# EAGLE design mainboard-raspi (EAGLE 6.4)
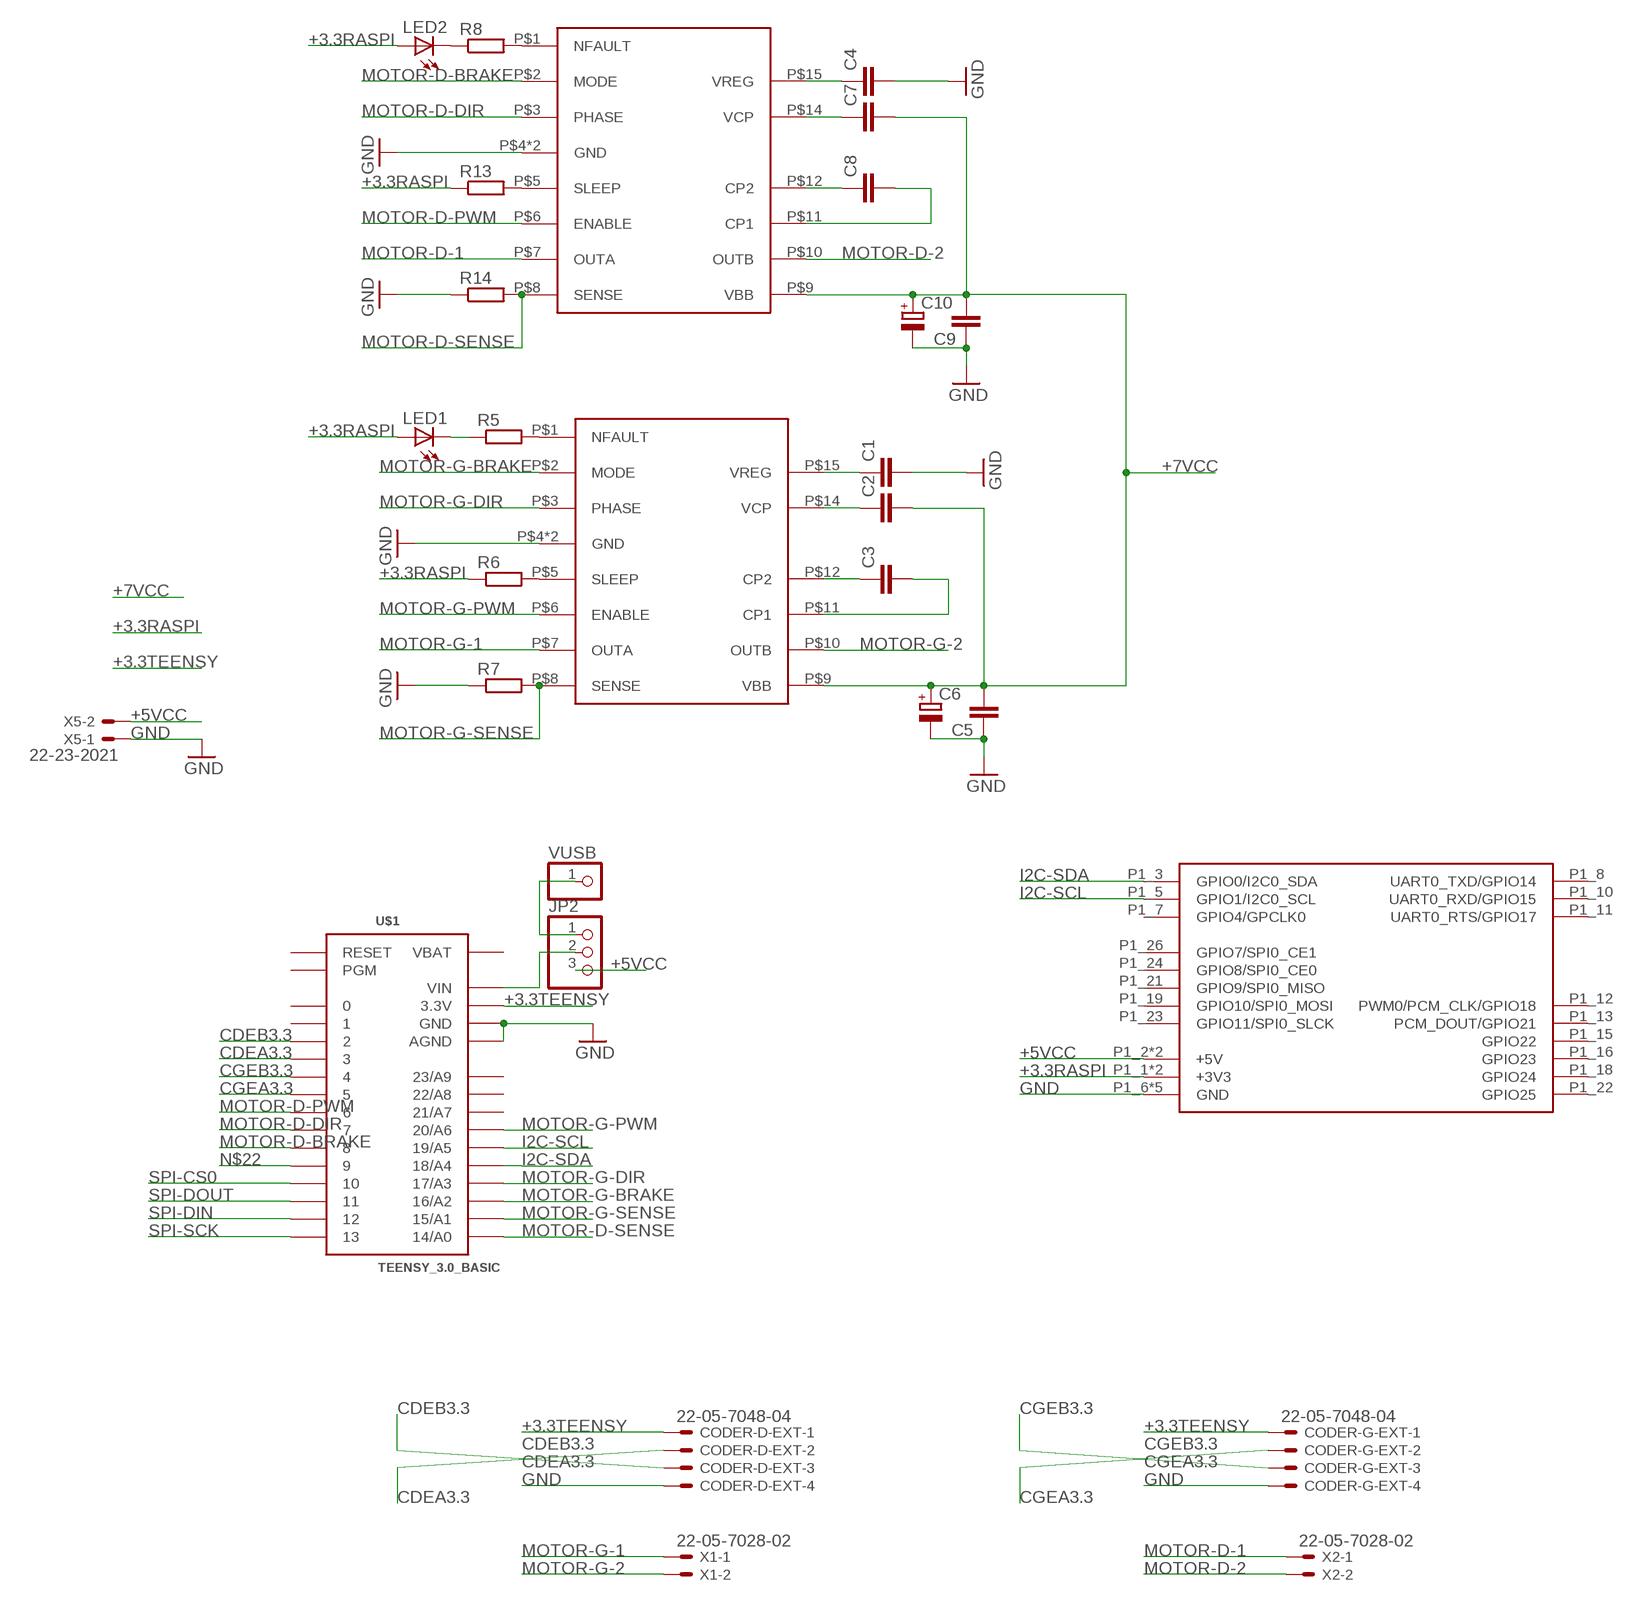
[diagram p0: schematic, sheet 1]

## Parts
C1  C-EUC0805K  [C0805K]
C2  C-EUC0805K  [C0805K]
C3  C-EUC0805K  [C0805K]
C4  C-EUC0805K  [C0805K]
C5  C-EUC0805K  [C0805K]
C6  CPOL-EUE3.5-8  [E3,5-8]
C7  C-EUC0805K  [C0805K]
C8  C-EUC0805K  [C0805K]
C9  C-EUC0805K  [C0805K]
C10  CPOL-EUE3.5-8  [E3,5-8]
CODER-D-EXT  22-05-7048-04  [7395-04]
CODER-G-EXT  22-05-7048-04  [7395-04]
JP2  PINHD-1X3  [1X03]
LED1  LED3MM  [LED3MM]
LED2  LED3MM  [LED3MM]
R5  R-EU_R0805W  [R0805W]
R6  R-EU_R0805W  [R0805W]
R7  R-EU_R0805W  [R0805W]
R8  R-EU_R0805W  [R0805W]
R13  R-EU_R0805W  [R0805W]
R14  R-EU_R0805W  [R0805W]
U$1  TEENSY_3.0_BASIC  [TEENSY_3.0_BASIC]
U$3  A3950-DIL  [DIL16]
U$4  A3950-DIL  [DIL16]
U$5  RPI-B-V1SHIELD  [RPI-B-V1-SHIELD]
VUSB  PINHD-1X1  [1X01]
X1  22-05-7028-02  [7395-02]
X2  22-05-7028-02  [7395-02]
X5  22-23-2021  [22-23-2021]

## Nets
+3.3RASPI: LED1.A LED2.A R6.1 R13.1 U$5.P1_1(+3V3) U$5.P1_17(+3V3)
+3.3TEENSY: CODER-D-EXT.1 CODER-G-EXT.1 U$1.3.3V U$1.3.3V1(3.3V)
+5VCC: JP2.3 U$5.P1_2(+5V) U$5.P1_4(+5V) X5.2
+7VCC: C2.2 C5.2 C6.+ C7.2 C9.2 C10.+ U$3.P$9(VBB) U$4.P$9(VBB)
CDEA3.3: CODER-D-EXT.2 U$1.3
CDEB3.3: CODER-D-EXT.3 U$1.2
CGEA3.3: CODER-G-EXT.2 U$1.5
CGEB3.3: CODER-G-EXT.3 U$1.4
GND: C1.2 C4.2 C5.1 C6.- C9.1 C10.- CODER-D-EXT.4 CODER-G-EXT.4 R7.1 R14.1 U$1.AGND U$1.GND U$1.GND1(GND) U$3.P$4(GND) U$3.P$13(GND) U$4.P$4(GND) U$4.P$13(GND) U$5.P1_6(GND) U$5.P1_9(GND) U$5.P1_14(GND) U$5.P1_20(GND) U$5.P1_25(GND) X5.1
I2C-SCL: U$1.19/A5 U$5.P1_5(GPIO1/I2C0_SCL)
I2C-SDA: U$1.18/A4 U$5.P1_3(GPIO0/I2C0_SDA)
MOTOR-D-1: U$4.P$7(OUTA) X2.1
MOTOR-D-2: U$4.P$10(OUTB) X2.2
MOTOR-D-BRAKE: U$1.8 U$4.P$2(MODE)
MOTOR-D-DIR: U$1.7 U$4.P$3(PHASE)
MOTOR-D-PWM: U$1.6 U$4.P$6(ENABLE)
MOTOR-D-SENSE: R14.2 U$1.14/A0 U$4.P$8(SENSE)
MOTOR-G-1: U$3.P$7(OUTA) X1.1
MOTOR-G-2: U$3.P$10(OUTB) X1.2
MOTOR-G-BRAKE: U$1.16/A2 U$3.P$2(MODE)
MOTOR-G-DIR: U$1.17/A3 U$3.P$3(PHASE)
MOTOR-G-PWM: U$1.20/A6 U$3.P$6(ENABLE)
MOTOR-G-SENSE: R7.2 U$1.15/A1 U$3.P$8(SENSE)
N$3: JP2.2 U$1.VIN
N$4: JP2.1 VUSB.1
N$5: R5.2 U$3.P$1(NFAULT)
N$6: R6.2 U$3.P$5(SLEEP)
N$7: R8.2 U$4.P$1(NFAULT)
N$8: C1.1 U$3.P$15(VREG)
N$9: C2.1 U$3.P$14(VCP)
N$10: C3.1 U$3.P$12(CP2)
N$11: LED1.K(C) R5.1
N$12: R13.2 U$4.P$5(SLEEP)
N$13: C4.1 U$4.P$15(VREG)
N$14: C7.1 U$4.P$14(VCP)
N$15: C3.2 U$3.P$11(CP1)
N$16: C8.1 U$4.P$12(CP2)
N$18: C8.2 U$4.P$11(CP1)
N$20: LED2.K(C) R8.1
N$22: U$1.9
SPI-CS0: U$1.10
SPI-DIN: U$1.12
SPI-DOUT: U$1.11
SPI-SCK: U$1.13
Unconnected: U$1.0 U$1.1 U$1.21/A7 U$1.22/A8 U$1.23/A9 U$1.PGM U$1.RESET U$5.P1_7(GPIO4/GPCLK0) U$5.P1_8(UART0_TXD/GPIO14) U$5.P1_10(UART0_RXD/GPIO15) U$5.P1_11(UART0_RTS/GPIO17) U$5.P1_12(PWM0/PCM_CLK/GPIO18) U$5.P1_13(PCM_DOUT/GPIO21) U$5.P1_15(GPIO22) U$5.P1_16(GPIO23) U$5.P1_18(GPIO24) U$5.P1_19(GPIO10/SPI0_MOSI) U$5.P1_21(GPIO9/SPI0_MISO) U$5.P1_22(GPIO25) U$5.P1_23(GPIO11/SPI0_SLCK) U$5.P1_24(GPIO8/SPI0_CE0) U$5.P1_26(GPIO7/SPI0_CE1)

## Power pins joined to a net without a drawn wire
VBAT: U$1.VBAT

## Library data of the parts
C1-C5 C7-C9 = rcl:C-EU: CAPACITOR, European symbol
C6 C10 = rcl:CPOL-EU: POLARIZED CAPACITOR, European symbol
CODER-D-EXT CODER-G-EXT = con-molex:22-?-04: CONNECTOR wire to board 2.54 mm (.1 inch) pitch header; OC_FARNELL: unknown; OC_NEWARK: unknown
JP2 = pinhead:PINHD-1X3: PIN HEADER
LED1 LED2 = led:LED: LED OSRAM: - CHIPLED LG R971, LG N971, LY N971, LG Q971, LY Q971, LO R971, LY R971 LH N974, LH R974 LS Q976, LO Q976, LY Q976 LO Q996 - Hyper CHIPLED LW Q18S LB Q993, LB Q99A, LB R99A - SideLED LS A670, LO A670, LY A670, LG A670, LP A670 LB A673, LV A673, LT A673, LW A673 LH A674 LY A675 LS A676, LA A676, LO A676, LY A676, LW A676 LS A679, LY A679, LG A679 - Hyper Micro SIDELED® LS Y876, LA Y876, LO Y876, LY Y876 LT Y87S - SmartLED LW L88C, LW L88S LB L89C, LB L89S, LG L890 LS L89K, LO L89K, LY L89K LS L896, LA L896, LO L896, LY L896 - TOPLED LS T670, LO T670, LY T670, LG T670, LP T670 LSG T670, LSP T670, LSY T670, LOP T670, LYG T670 LG T671, LOG T671, LSG T671 LB T673, LV T673, LT T673, LW T673 LH T674 LS T676, LA T676, LO T676, LY T676, LB T676, LH T676, LSB T676, LW T676 LB T67C, LV T67C, LT T67C, LS T67K, LO T67K, LY T67K, LW E67C LS E67B, LA E67B, LO E67B, LY E67B, LB E67C, LV E67C, LT E67C LW T67C LS T679, LY T679, LG T679 LS T770, LO T770, LY T770, LG T770, LP T770 LB T773, LV T773, LT T773, LW T773 LH T774 LS E675, LA E675, LY E675, LS T675 LS T776, LA T776, LO T776, LY T776, LB T776 LHGB T686 LT T68C, LB T68C - Hyper Mini TOPLED® LB M676 - Mini TOPLED Santana® LG M470 LS M47K, LO M47K, LY M47K Source: http://www.osram.convergy.de LUXEON: - LUMILED® LXK2-PW12-R00, LXK2-PW12-S00, LXK2-PW14-U00, LXK2-PW14-V00 LXK2-PM12-R00, LXK2-PM12-S00, LXK2-PM14-U00 LXK2-PE12-Q00, LXK2-PE12-R00, LXK2-PE12-S00, LXK2-PE14-T00, LXK2-PE14-U00 LXK2-PB12-K00, LXK2-PB12-L00, LXK2-PB12-M00, LXK2-PB14-N00, LXK2-PB14-P00, LXK2-PB14-Q00 LXK2-PR12-L00, LXK2-PR12-M00, LXK2-PR14-Q00, LXK2-PR14-R00 LXK2-PD12-Q00, LXK2-PD12-R00, LXK2-PD12-S00 LXK2-PH12-R00, LXK2-PH12-S00 LXK2-PL12-P00, LXK2-PL12-Q00, LXK2-PL12-R00 Source: www.luxeon.com KINGBRIGHT: KA-3528ASYC Source: www.kingbright.com
R5-R8 R13 R14 = rcl:R-EU_: RESISTOR, European symbol
U$1 = Teensy3.0:TEENSY_3.0_BASIC: Basic Teensy 3.0 with none of the 'inner' pins enabled. See '+4', 'AllAnalogPins", and 'AllPins' packages for additional pin holes, as needed.
U$3 U$4 = A3950:A3950-DIL
U$5 = raspberry:RPI-B-V1: First revision of the Model B board without P5 and P6 headers and mounting holes. Choose the "SHIELD" variant for a predefined Dimension layer.
VUSB = pinhead:PINHD-1X1: PIN HEADER
X1 X2 = con-molex:22-?-02: CONNECTOR wire to board 2.54 mm (.1 inch) pitch header; OC_FARNELL: 9731601; OC_NEWARK: unknown
X5 = con-molex:22-23-2021: .100" (2.54mm) Center Header - 2 Pin; MF: MOLEX; MPN: 22-23-2021; OC_FARNELL: 1462926; OC_NEWARK: 25C3832

## Board
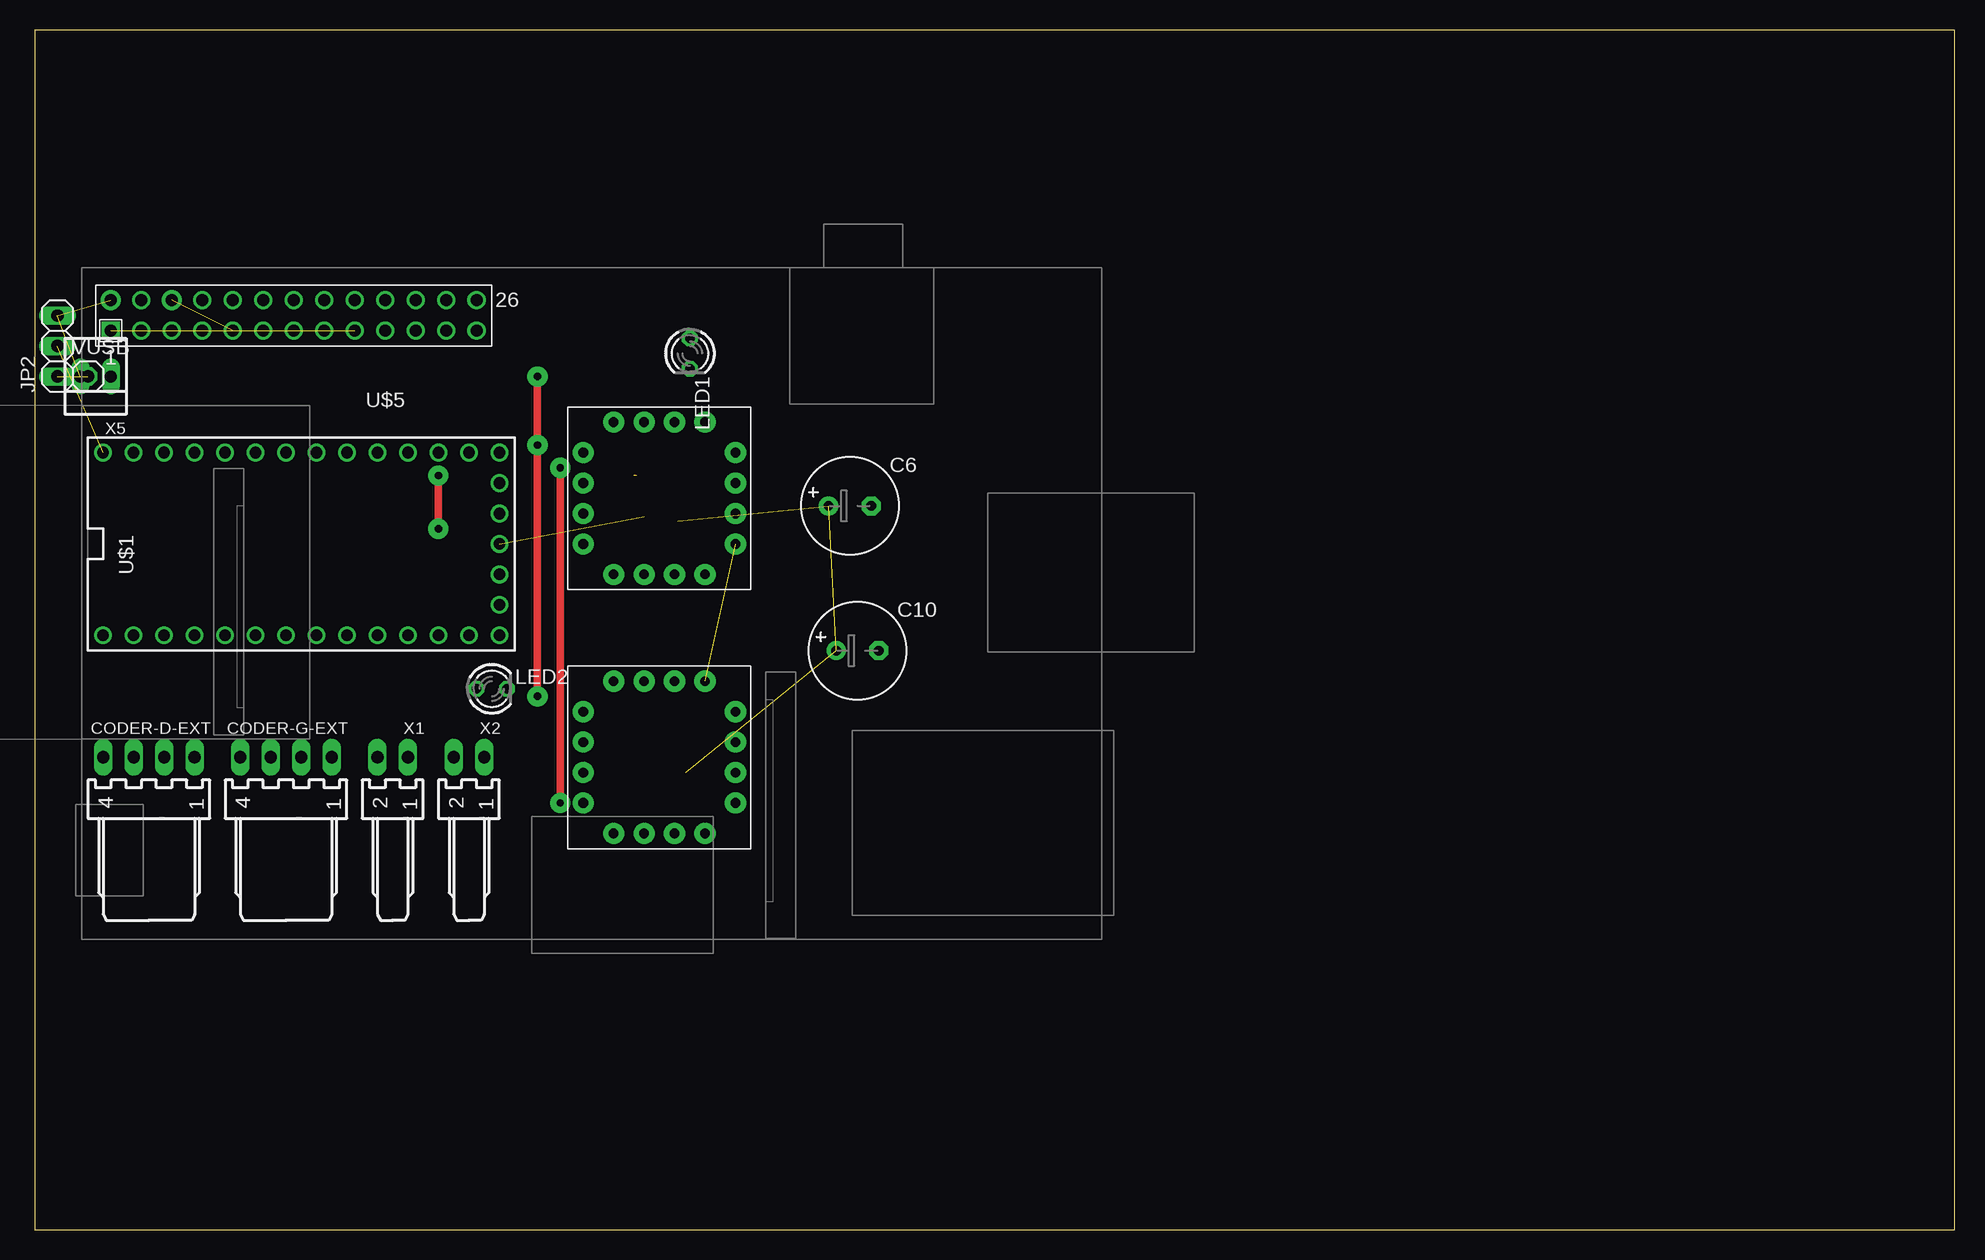
[diagram p1: board, top side]
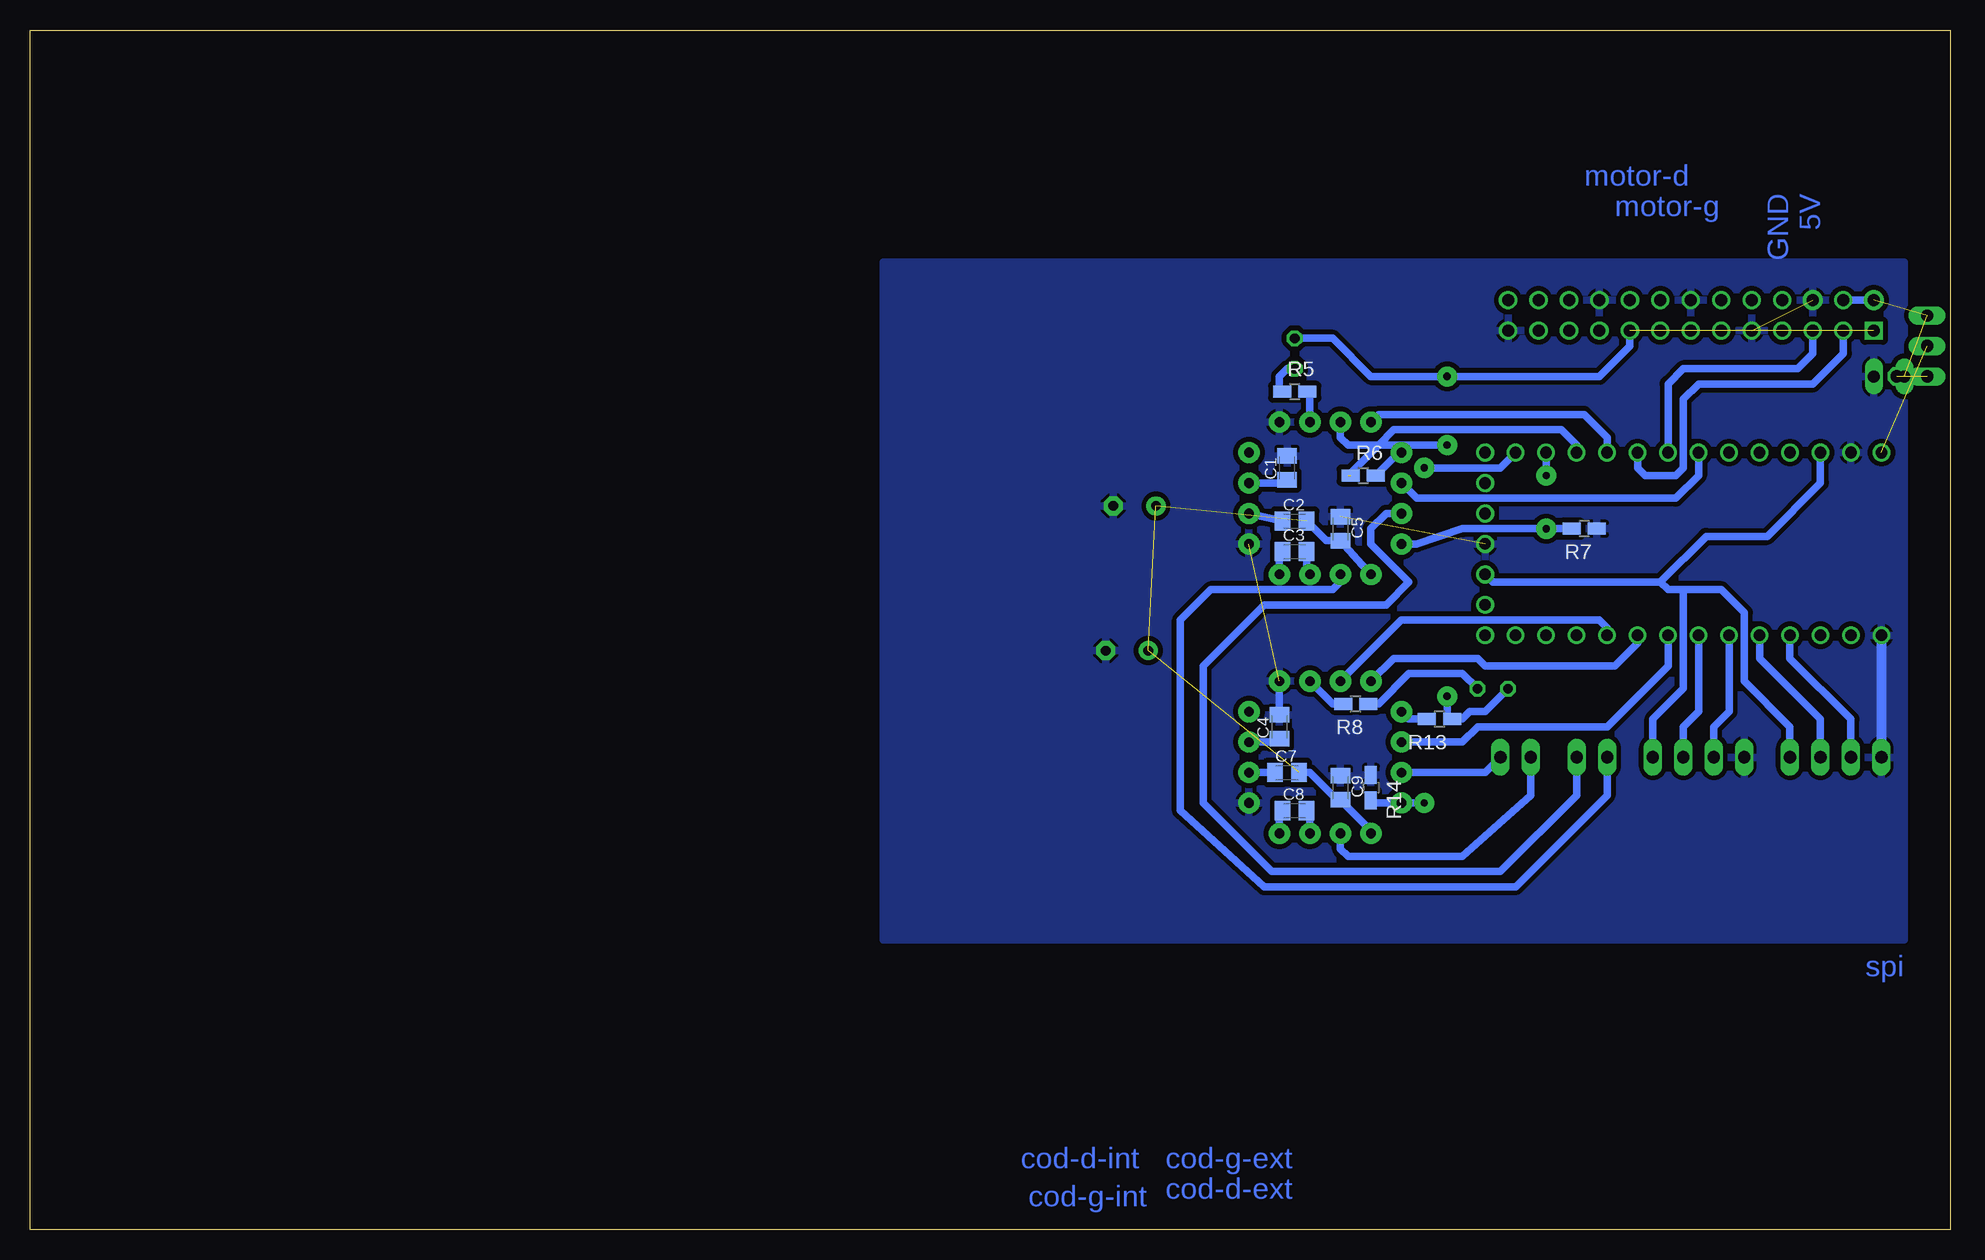
[diagram p2: board, bottom side, seen from below]

Size 160 x 100 mm. Coordinates in mm from the lower left corner, seen from the top.
Outline: 0,0 160,0 160,100 0,100 0,0
Copper layers (1*16): Top 0.035mm / dielectric 1.5mm / Bottom 0.035mm
Design rules "default": minimum track width 10mil, minimum drill 24mil, track to track 8mil, track to pad 8mil, pad to pad 8mil, via to via 8mil, smd to smd 8mil, copper to edge 40mil, drill to drill 8mil, minimum pad ring 10mil, minimum via ring 8mil, stop-mask expansion 4mil, vias tented up to drill 0mil, thermal gap 10mil

### Footprints (pad centres in the part's own frame; a part is rotated, then mirrored left to right if it is on the bottom)
C0805K = smd 1.3 x 1.6: 1 -1,0; 2 1,0
E3,5-8 = drill 0.813 pad 1.6: + -1.778,0 | drill 0.813 pad 1.6 octagon: - 1.778,0
7395-04 = drill 1.016 long: 1 3.81,0; 2 1.27,0; 3 -1.27,0; 4 -3.81,0
1X03 = drill 1.016 long: 1 -2.54,0; 2 0,0; 3 2.54,0
LED3MM = drill 0.813 octagon: A -1.27,0; K 1.27,0
R0805W = smd 1.5 x 1: 1 -1.052,0; 2 1.052,0
TEENSY_3.0_BASIC = drill 0.965: 0 -7.62,13.97; 1 -7.62,11.43; 2 -7.62,8.89; 3 -7.62,6.35; 3.3V 7.62,11.43; 3.3V1 -2.54,-16.51; 4 -7.62,3.81; 5 -7.62,1.27; 6 -7.62,-1.27; 7 -7.62,-3.81; 8 -7.62,-6.35; 9 -7.62,-8.89; 10 -7.62,-11.43; 11 -7.62,-13.97; 12 -7.62,-16.51; 13 7.62,-16.51; 14/A0 7.62,-13.97; 15/A1 7.62,-11.43; 16/A2 7.62,-8.89; 17/A3 7.62,-6.35; 18/A4 7.62,-3.81; 19/A5 7.62,-1.27; 20/A6 7.62,1.27; 21/A7 7.62,3.81; 22/A8 7.62,6.35; 23/A9 7.62,8.89; AGND 7.62,13.97; GND -7.62,16.51; GND1 0,-16.51; PGM 2.54,-16.51; RESET 5.08,-16.51; VBAT -5.08,-16.51; VIN 7.62,16.51
DIL16 = drill 0.8 pad 1.778: P$1 -1.27,-6.35; P$2 1.27,-6.35; P$3 3.81,-6.35; P$4 -3.81,-6.35; P$5 6.35,-3.81; P$6 6.35,-1.27; P$7 6.35,1.27; P$8 6.35,3.81; P$9 3.81,6.35; P$10 1.27,6.35; P$11 -1.27,6.35; P$12 -3.81,6.35; P$13 -6.35,3.81; P$14 -6.35,1.27; P$15 -6.35,-1.27; P$16 -6.35,-3.81
RPI-B-V1-SHIELD = drill 1 square: P1_1 0,0 | drill 1 pad 1.676: P1_2 0,2.54; P1_6 5.08,2.54 | drill 1: P1_3 2.54,0; P1_4 2.54,2.54; P1_5 5.08,0; P1_7 7.62,0; P1_8 7.62,2.54; P1_9 10.16,0; P1_10 10.16,2.54; P1_11 12.7,0; P1_12 12.7,2.54; P1_13 15.24,0; P1_14 15.24,2.54; P1_15 17.78,0; P1_16 17.78,2.54; P1_17 20.32,0; P1_18 20.32,2.54; P1_19 22.86,0; P1_20 22.86,2.54; P1_21 25.4,0; P1_22 25.4,2.54; P1_23 27.94,0; P1_24 27.94,2.54; P1_25 30.48,0; P1_26 30.48,2.54
1X01 = drill 1.016 octagon: 1 0,0
7395-02 = drill 1.016 long: 1 1.27,0; 2 -1.27,0
22-23-2021 = drill 1 long: 1 -1.27,0; 2 1.27,0

### Placement (x,y rotation side)
C1  55.24,63.5 90 bottom
C2  54.61,59.05 0 bottom
C3  54.61,56.52 0 bottom
C4  55.88,41.91 90 bottom
C5  50.8,58.42 270 bottom
C6  67.94,60.32 0 top
C7  55.24,38.1 0 bottom
C8  54.61,34.92 0 bottom
C9  50.8,36.83 270 bottom
C10  68.58,48.26 0 top
CODER-D-EXT  9.53,39.37 0 top
CODER-G-EXT  20.95,39.37 0 top
JP2  1.9,73.66 90 top
LED1  54.61,73.03 270 top
LED2  38.1,45.09 0 top
R5  54.61,69.85 0 bottom
R6  48.9,62.86 0 bottom
R7  30.48,58.42 180 bottom
R8  49.53,43.81 180 bottom
R13  42.55,42.55 180 bottom
R14  48.26,36.83 270 bottom
U$1  22.23,57.15 90 top
U$3  52.07,60.96 180 top
U$4  52.07,39.37 180 top
U$5  6.35,74.93 0 top
VUSB  4.45,71.12 0 top
X1  29.84,39.37 0 top
X2  36.2,39.37 0 top
X5  5.08,71.12 180 top

### Tracks (layer width: path | path; a pad name or v marks a point on that pad's centre or on a via)
+3.3RASPI  (via drill 0.6 pad 1.68)  (2 unrouted)
  Top 0.61: v41.91,71.12 v41.91,65.41 v41.91,44.45
  Bottom 0.61: 50.16,63.08 R6.1 | U$5.P1_17 26.67,73.66 29.21,71.12 v41.91,71.12 48.26,71.12 51.44,74.3 LED1.A | LED1.A | v41.91,65.41 47.62,65.41 50.16,62.87 | v41.91,44.45 41.91,42.76 R13.1 40.64,42.55 40.01,43.18 38.73,43.18 LED2.A
+3.3TEENSY
  Bottom 0.61: 24.13,53.98 20.32,57.78 15.24,57.78 10.79,62.23 U$1.3.3V | CODER-D-EXT.1 13.34,41.91 17.14,45.72 17.14,51.44 19.05,53.34 22.23,53.34 | 22.23,53.34 23.5,53.34 24.13,53.98 | CODER-G-EXT.1 24.77,42.55 22.23,45.09 22.23,53.34 | 24.13,53.98 38.1,53.98 U$1.3.3V1
+5VCC  (2 unrouted)
  Bottom 0.61: U$5.P1_2 U$5.P1_4
+7VCC  (3 unrouted)
  Bottom 0.61: U$3.P$9 C5.2 51.98,57.42 C2.2 | U$4.P$9 48.26,33.29 C9.2 51.07,35.83 53.34,38.1 C7.2
CDEA3.3
  Bottom 0.61: CODER-D-EXT.2 10.79,42.55 15.88,47.62 U$1.3
CDEB3.3
  Bottom 0.61: CODER-D-EXT.3 8.26,42.55 13.34,47.62 U$1.2
CGEA3.3
  Bottom 0.61: CODER-G-EXT.2 22.23,41.91 20.95,43.18 U$1.5
CGEB3.3
  Bottom 0.61: CODER-G-EXT.3 19.68,41.91 18.41,43.18 U$1.4
GND  (3 unrouted)
  Bottom 0.61: U$4.P$4 C4.2
  Bottom 0.813: U$1.GND CODER-D-EXT.4
  pour Bottom (isolate 0.406): 3.81,80.64 3.81,24.13 88.9,24.13 88.9,80.64
I2C-SCL
  Bottom 0.61: U$5.P1_5 11.43,73.03 12.7,71.75 22.23,71.75 23.5,70.48 U$1.19/A5
I2C-SDA
  Bottom 0.61: U$1.18/A4 26.04,63.5 25.4,62.87 22.86,62.87 22.23,63.5 22.23,69.22 20.95,70.48 11.43,70.48 8.89,73.03 U$5.P1_3
MOTOR-D-1
  Bottom 0.61: U$4.P$7 38.73,38.1 X2.1
MOTOR-D-2
  Bottom 0.61: X2.2 34.92,36.2 40.64,31.11 50.16,31.11 50.8,31.75 U$4.P$10
MOTOR-D-BRAKE
  Bottom 0.61: U$1.8 28.57,50.16 29.21,50.8 45.72,50.8 U$4.P$2
MOTOR-D-DIR
  Bottom 0.61: U$1.7 26.04,48.9 27.94,46.99 38.73,46.99 39.37,47.62 46.35,47.62 U$4.P$3
MOTOR-D-PWM
  Bottom 0.61: U$1.6 23.5,46.99 28.57,41.91 39.37,41.91 40.64,40.64 U$4.P$6
MOTOR-D-SENSE  (via drill 0.6 pad 1.68)
  Top 0.61: v43.81,35.56 v43.81,63.5
  Bottom 0.61: R14.2 48.04,35.56 U$4.P$8 v43.81,35.56 | v43.81,63.5 37.47,63.5 U$1.14/A0
MOTOR-G-1
  Bottom 0.61: X1.1 31.11,36.2 37.47,29.84 56.52,29.84 62.23,35.56 62.23,46.99 57.15,52.07 46.99,52.07 45.09,53.98 48.26,57.15 48.26,58.42 46.99,59.69 U$3.P$7
MOTOR-G-2
  Bottom 0.61: X1.2 28.57,36.2 36.2,28.57 57.15,28.57 64.14,34.92 64.14,50.8 61.59,53.34 51.44,53.34 50.8,53.98 U$3.P$10
MOTOR-G-BRAKE
  Bottom 0.61: U$1.16/A2 31.11,65.41 32.38,66.67 46.35,66.67 47.62,65.41 50.16,65.41 50.8,66.04 U$3.P$2
MOTOR-G-DIR
  Bottom 0.61: U$1.17/A3 28.57,66.04 30.48,67.94 47.62,67.94 U$3.P$3
MOTOR-G-PWM
  Bottom 0.61: U$1.20/A6 20.95,62.87 22.86,60.96 44.45,60.96 U$3.P$6
MOTOR-G-SENSE  (via drill 0.6 pad 1.68)
  Top 0.61: v33.66,62.87 v33.66,58.42
  Bottom 0.61: U$1.15/A1 v33.66,62.87 | U$3.P$8 44.45,57.15 40.64,58.42 v33.66,58.42 R7.2
N$3  (1 unrouted)
N$4  (1 unrouted)
N$5
  Bottom 0.61: U$3.P$1 53.34,69.63 R5.2
N$6
  Bottom 0.61: U$3.P$5 45.94,64.77 R6.2
N$7
  Bottom 0.61: U$4.P$1 51.44,43.81 R8.2
N$8
  Bottom 0.61: U$3.P$15 55.52,62.23 C1.1
N$9
  Bottom 0.61: U$3.P$14 C2.1
N$10
  Bottom 0.61: U$3.P$12 55.88,56.88 C3.1
N$11
  Bottom 0.61: LED1.K 55.24,71.75 55.88,71.12 55.88,70.07 R5.1
N$12
  Bottom 0.61: R13.2 45.09,42.55 U$4.P$5
N$13
  Bottom 0.61: U$4.P$15 56.78,40.64 C4.1
N$14
  Bottom 0.61: U$4.P$14 C7.1
N$15
  Bottom 0.61: C3.2 53.61,54.24 U$3.P$11
N$16
  Bottom 0.61: U$4.P$12 55.88,34.66 C8.1
N$18
  Bottom 0.61: U$4.P$11 53.34,34.66 C8.2
N$20
  Bottom 0.61: R8.1 47.62,43.81 45.09,46.35 40.64,46.35 LED2.K

### Text on the board
Bottom: motor-d | GND / 5V | motor-g | spi | cod-g-ext | cod-d-int | cod-d-ext | cod-g-int